# EAGLE design AlarmClock (EAGLE 9.6.2)
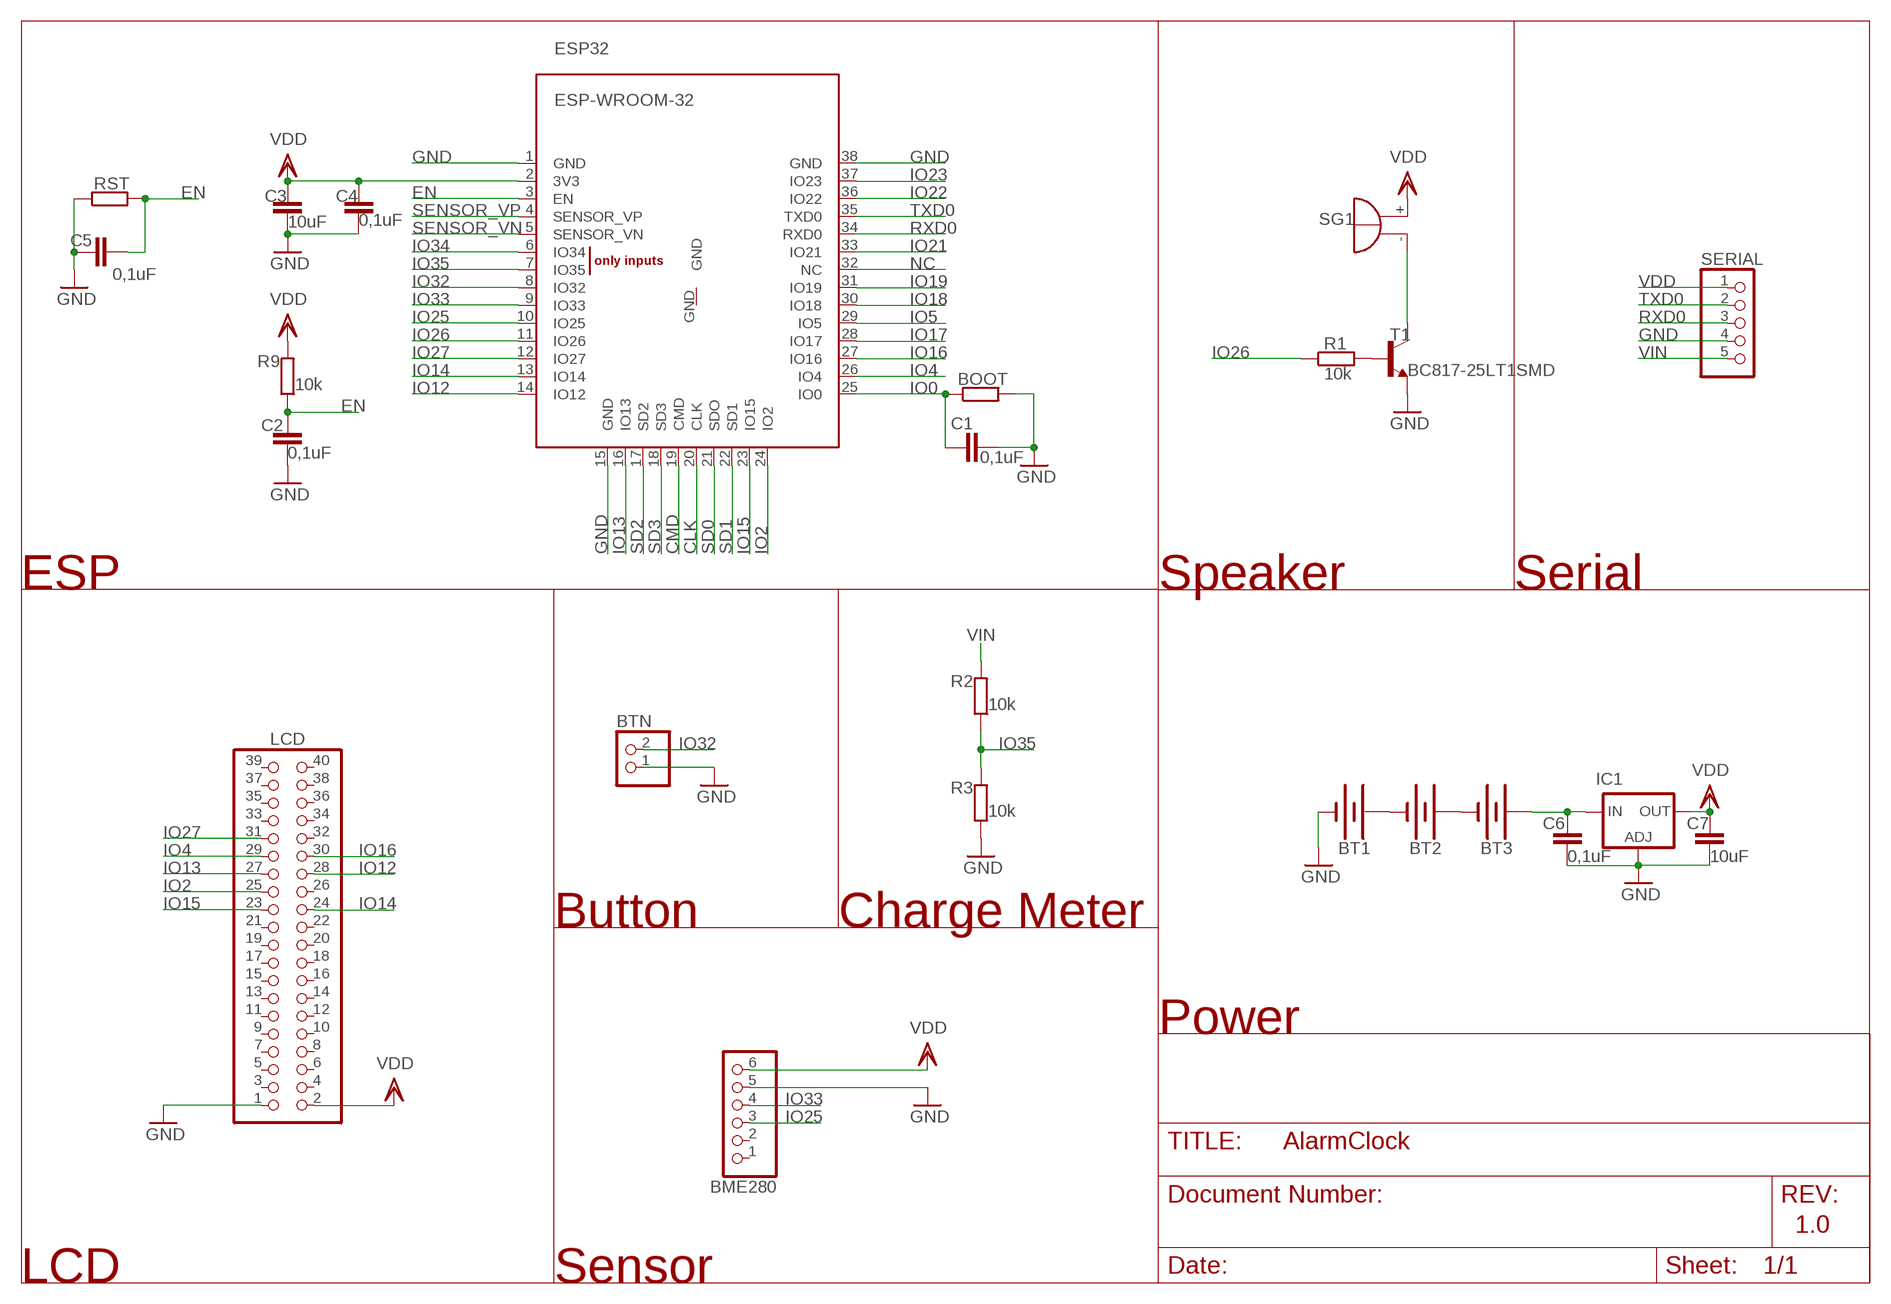
[diagram p0: schematic, sheet 1]

## Parts
BME280  PINHD-1X6  [1X06]
BOOT  R-EU_R1206  [R1206]
BT1  HALTER1XUM4-LF  [HALTER1XUM4-LF]
BT2  HALTER1XUM4-LF  [HALTER1XUM4-LF]
BT3  HALTER1XUM4-LF  [HALTER1XUM4-LF]
BTN  PINHD-1X2_2.54  [1X02]
C1  0,1uF  C-EUC1206  [C1206]
C2  0,1uF  C-EUC1206  [C1206]
C3  10uF  C-EUC1206  [C1206]
C4  0,1uF  C-EUC1206  [C1206]
C5  0,1uF  C-EUC1206  [C1206]
C6  0,1uF  C-EUC1206  [C1206]
C7  10uF  C-EUC1206  [C1206]
ESP32  ESP-WROOM-32  [ESP-WROOM-32]
IC1  LD1117AS33TR  LD117AS33TR  [SOT223]
LCD  PINHD-2X20  [2X20]
R1  10k  R-EU_R1206  [R1206]
R2  10k  R-EU_R1206  [R1206]
R3  10k  R-EU_R1206  [R1206]
R9  10k  R-EU_R1206  [R1206]
RST  R-EU_R1206  [R1206]
SERIAL  PINHD-1X5_2.54-SMD-90°  [1X05SMD/90]
SG1  F/QMB  [F/QMB]
T1  BC817-25LT1SMD  [SOT23-BEC]

## Nets
CLK: ESP32.20(CLK)
CMD: ESP32.19(CMD)
EN: C2.2 C5.2 ESP32.3(EN) R9.1 RST.2
GND: BME280.5 BOOT.2 BT1.P$2(-) BTN.1 C1.1 C2.1 C3.1 C4.1 C5.1 C6.1 C7.1 ESP32.1(GND) ESP32.15(GND) ESP32.38(GND) IC1.1(ADJ) LCD.1 R3.1 RST.1 SERIAL.4 T1.E
IO0: BOOT.1 C1.2 ESP32.25(IO0)
IO2: ESP32.24(IO2) LCD.25
IO4: ESP32.26(IO4) LCD.29
IO5: ESP32.29(IO5)
IO12: ESP32.14(IO12) LCD.28
IO13: ESP32.16(IO13) LCD.27
IO14: ESP32.13(IO14) LCD.24
IO15: ESP32.23(IO15) LCD.23
IO16: ESP32.27(IO16) LCD.30
IO17: ESP32.28(IO17)
IO18: ESP32.30(IO18)
IO19: ESP32.31(IO19)
IO21: ESP32.33(IO21)
IO22: ESP32.36(IO22)
IO23: ESP32.37(IO23)
IO25: BME280.3 ESP32.10(IO25)
IO26: ESP32.11(IO26) R1.1
IO27: ESP32.12(IO27) LCD.31
IO32: BTN.2 ESP32.8(IO32)
IO33: BME280.4 ESP32.9(IO33)
IO34: ESP32.6(IO34)
IO35: ESP32.7(IO35) R2.1 R3.2
N$1: SG1.-(+) T1.C
N$5: BT1.P$1(+) BT2.P$2(-)
N$6: BT2.P$1(+) BT3.P$2(-)
N$7: R1.2 T1.B
NC: ESP32.32(NC)
RXD0: ESP32.34(RXD0) SERIAL.3
SD0: ESP32.21(SDO)
SD1: ESP32.22(SD1)
SD2: ESP32.17(SD2)
SD3: ESP32.18(SD3)
SENSOR_VN: ESP32.5(SENSOR_VN)
SENSOR_VP: ESP32.4(SENSOR_VP)
TXD0: ESP32.35(TXD0) SERIAL.2
VDD: BME280.6 C3.2 C4.2 C7.2 ESP32.2(3V3) IC1.4(OUT) LCD.2 R9.2 SERIAL.1 SG1.+(-)
VIN: BT3.P$1(+) C6.2 IC1.3(IN) R2.2 SERIAL.5
Unconnected: BME280.1 BME280.2 ESP32.GND LCD.3 LCD.4 LCD.5 LCD.6 LCD.7 LCD.8 LCD.9 LCD.10 LCD.11 LCD.12 LCD.13 LCD.14 LCD.15 LCD.16 LCD.17 LCD.18 LCD.19 LCD.20 LCD.21 LCD.22 LCD.26 LCD.32 LCD.33 LCD.34 LCD.35 LCD.36 LCD.37 LCD.38 LCD.39 LCD.40

## Notes on the sheet
- ESP | Speaker | Serial
- Button | Charge Meter
- Power
- 1.0
- LCD | Sensor

## Library data of the parts
BME280 = pinhead:PINHD-1X6: PIN HEADER
BOOT R1-R3 R9 RST = rcl:R-EU_: RESISTOR, European symbol; SPICEPREFIX: R
BT1-BT3 = TheLibrary:HALTER1XUM4-LF
BTN = pinhead-ext:PINHD-1X2: PIN HEADER
C1-C7 = rcl:C-EU: CAPACITOR, European symbol; SPICEPREFIX: C
ESP32 = esp32:ESP-WROOM-32
IC1 = v-reg:LD117A?*: Low drop fixed and adjustable positive voltage regulators 1 A Source: http://www.st.com/stonline/products/literature/ds/7194/ld1117axx.pdf
LCD = pinhead:PINHD-2X20: PIN HEADER
SERIAL = pinhead-ext:PINHD-1X5: PIN HEADER
SG1 = buzzer:F/QMB: BUZZER Source: Buerklin; OC_FARNELL: unknown; OC_NEWARK: unknown
T1 = transistor-npn:BC817*: NPN Transistor

## Net classes
1 power: width 0.178 mm

## Board
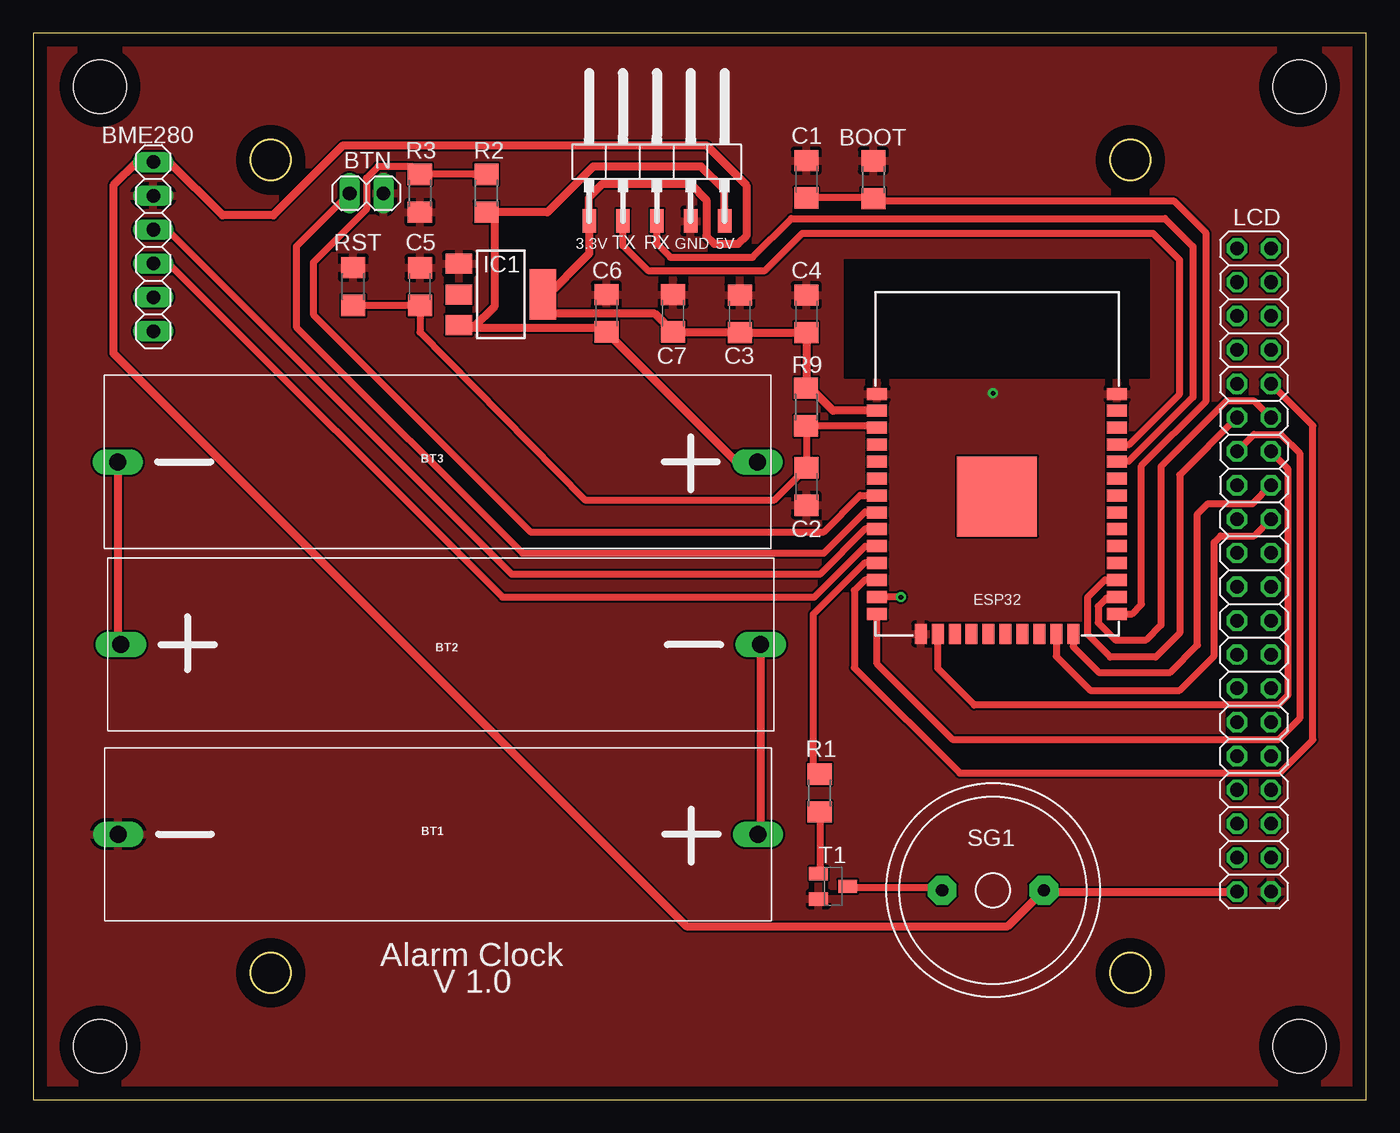
[diagram p1: board, top side]
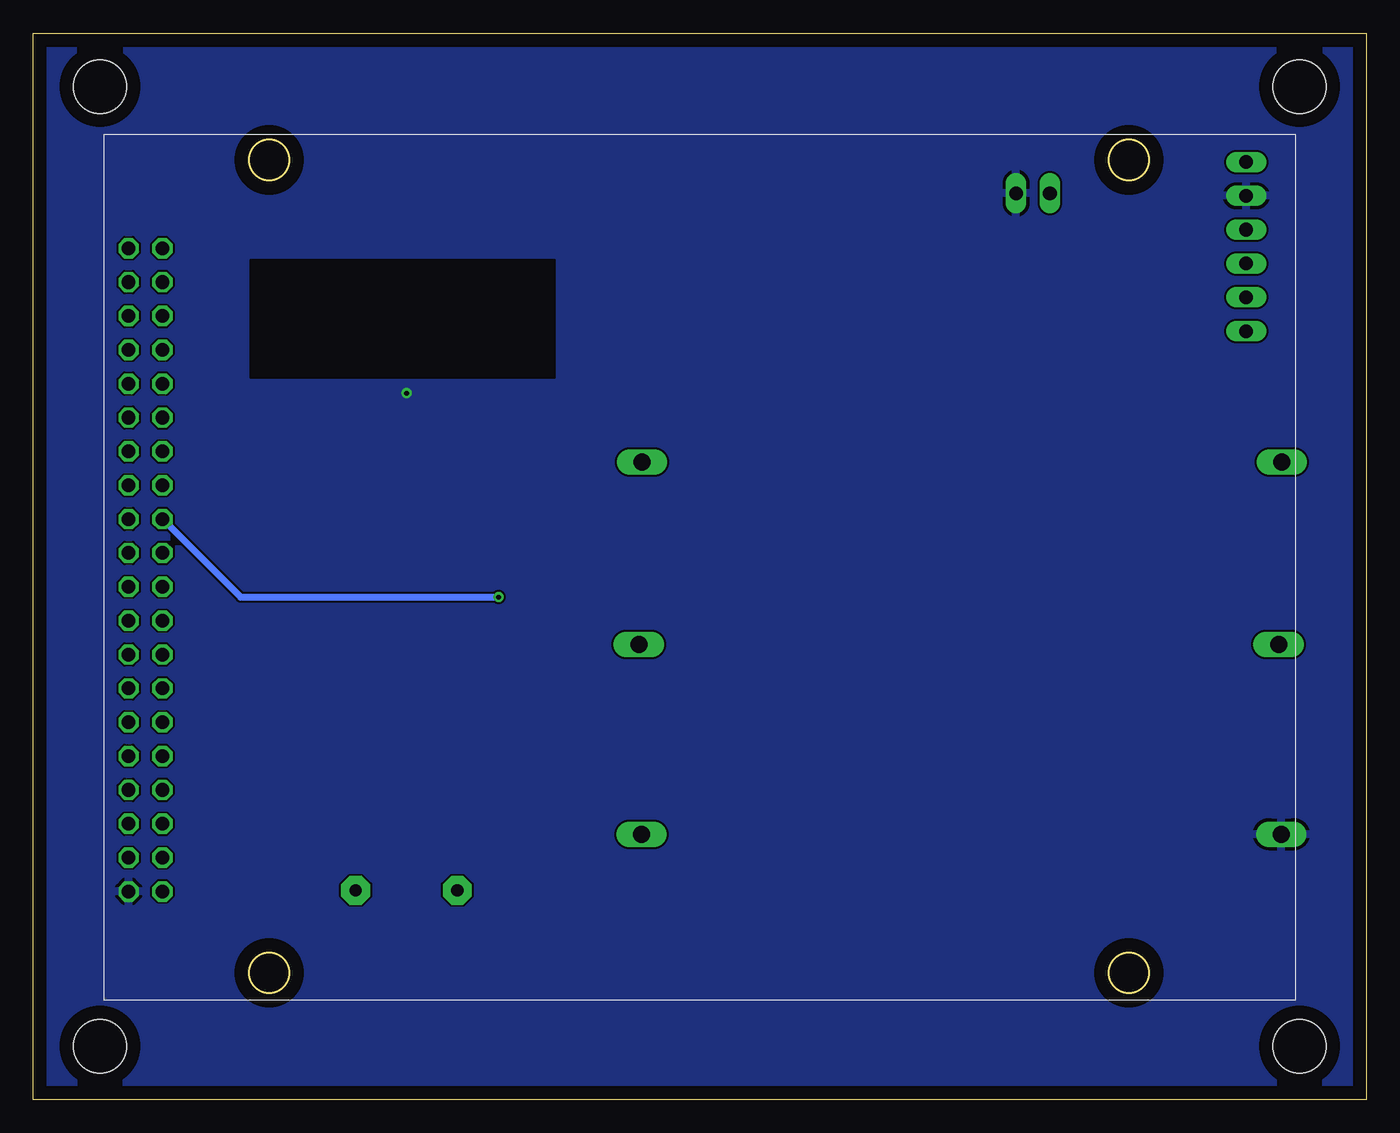
[diagram p2: board, bottom side, seen from below]

Size 100 x 80 mm. Coordinates in mm from the lower left corner, seen from the top.
Outline: 0,0 100,0 100,80 0,80 0,0
Outline: circle at 17.8,9.5 radius 1.5
Outline: circle at 82.3,9.5 radius 1.5
Outline: circle at 82.3,70.5 radius 1.5
Outline: circle at 17.8,70.5 radius 1.5
Copper layers (1*16): Top 0.035mm / dielectric 1.5mm / Bottom 0.035mm
Design rules "default": minimum track width 6mil, minimum drill 0.35mm, track to track 6mil, track to pad 6mil, pad to pad 6mil, via to via 6mil, smd to smd 6mil, copper to edge 40mil, drill to drill 6mil, minimum pad ring 10mil, minimum via ring 8mil, stop-mask expansion 4mil, vias tented up to drill 0mil, thermal gap 10mil
Holes 4 mm at 5,76 5,4 95,4 95,76

### Footprints (pad centres in the part's own frame; a part is rotated, then mirrored left to right if it is on the bottom)
1X06 = drill 1.016 long: 1 -6.35,0; 2 -3.81,0; 3 -1.27,0; 4 1.27,0; 5 3.81,0; 6 6.35,0
R1206 = smd 1.6 x 1.803: 1 -1.422,0; 2 1.422,0
HALTER1XUM4-LF = drill 1.27 long: P$1 -24.4,0.15; P$2 23.6,0.15
1X02 = drill 1.016 long: 1 -1.27,0; 2 1.27,0
C1206 = smd 1.6 x 1.8: 1 -1.4,0; 2 1.4,0
ESP-WROOM-32 = smd 0.9 x 1.5: 1 7.7,9; 2 6.43,9; 3 5.16,9; 4 3.89,9; 5 2.62,9; 6 1.35,9; 7 0.08,9; 8 -1.19,9; 9 -2.46,9; 10 -3.73,9; 11 -5,9; 12 -6.27,9; 13 -7.54,9; 14 -8.81,9; 25 -8.81,-9; 26 -7.54,-9; 27 -6.27,-9; 28 -5,-9; 29 -3.73,-9; 30 -2.46,-9; 31 -1.19,-9; 32 0.08,-9; 33 1.35,-9; 34 2.62,-9; 35 3.89,-9; 36 5.16,-9; 37 6.43,-9; 38 7.7,-9 | smd 1.5 x 0.9: 15 -10.3,5.715; 16 -10.3,4.445; 17 -10.3,3.175; 18 -10.3,1.905; 19 -10.3,0.635; 20 -10.3,-0.635; 21 -10.3,-1.905; 22 -10.3,-3.175; 23 -10.3,-4.445; 24 -10.3,-5.715 | smd 6 x 6: GND 0,0
SOT223 = smd 1.5 x 2: 1 -2.3,-3.15; 2 0,-3.15; 3 2.3,-3.15 | smd 3.8 x 2: 4 0,3.15
2X20 = drill 1.016 octagon: 1 -24.13,-1.27; 2 -24.13,1.27; 3 -21.59,-1.27; 4 -21.59,1.27; 5 -19.05,-1.27; 6 -19.05,1.27; 7 -16.51,-1.27; 8 -16.51,1.27; 9 -13.97,-1.27; 10 -13.97,1.27; 11 -11.43,-1.27; 12 -11.43,1.27; 13 -8.89,-1.27; 14 -8.89,1.27; 15 -6.35,-1.27; 16 -6.35,1.27; 17 -3.81,-1.27; 18 -3.81,1.27; 19 -1.27,-1.27; 20 -1.27,1.27; 21 1.27,-1.27; 22 1.27,1.27; 23 3.81,-1.27; 24 3.81,1.27; 25 6.35,-1.27; 26 6.35,1.27; 27 8.89,-1.27; 28 8.89,1.27; 29 11.43,-1.27; 30 11.43,1.27; 31 13.97,-1.27; 32 13.97,1.27; 33 16.51,-1.27; 34 16.51,1.27; 35 19.05,-1.27; 36 19.05,1.27; 37 21.59,-1.27; 38 21.59,1.27; 39 24.13,-1.27; 40 24.13,1.27
1X05SMD/90 = smd 1.016 x 1.778: 1 -1.27,-5.08; 2 1.27,-5.08; 3 3.81,-5.08; 4 6.35,-5.08; 5 8.89,-5.08
F/QMB = drill 0.914 pad 2.159 octagon: + 3.81,0; - -3.81,0
SOT23-BEC = smd 1 x 1.4: B -0.95,-1.1; C 0,1.1; E 0.95,-1.1

### Placement (x,y rotation side)
BME280  9,64 90 top
BOOT  63.02,69.01 90 top
BT1  29.97,20.05 180 top
BT2  30.97,33.99 0 top
BT3  29.93,47.99 180 top
BTN  25,68 180 top
C1  58,69.05 270 top
C2  58,46 90 top
C3  53,58.95 270 top
C4  58,58.95 270 top
C5  29,61 270 top
C6  43,59 270 top
C7  48,59 270 top
ESP32  72.3,45.25 90 top
IC1  35.08,60.41 270 top
LCD  91.58,39.74 90 top
R1  59,23 270 top
R2  34,68 270 top
R3  29,68 90 top
R9  57.98,51.96 90 top
RST  24,61 270 top
SERIAL  42.97,71 0 top
SG1  72,15.7 0 top
T1  60,16 270 top

### Tracks (layer width: path | path; a pad name or v marks a point on that pad's centre or on a via)
EN
  Top 0.508: ESP32.3 63.17,50.54 R9.1 58,50.52 C2.2 55.6,45 41.38,45 29,57.57 C5.2 | 29.42,59.02 C5.2 | C5.2 28.98,59.58 RST.2
GND  (via drill 0.35)
  other vias: 72,53
  pour Top: 0,80 100,80 100,0 0,0
  pour Bottom: 0,80 100,80 100,0 0,0
IO0
  Top 0.508: ESP32.25 82.44,36.44 83.15,37.15 83.15,47.55 88,52.41 88,65 85.61,67.39 63.22,67.39 BOOT.1 62.96,67.65 C1.2
IO2
  Top 0.508: ESP32.24 78.02,34.02 78,34 79.94,32.06 85.29,32.06 87.34,34.11 87.34,43.93 88.13,44.72 91.48,44.72 LCD.25
IO4
  Top 0.508: LCD.29 91.62,52.4 89.5,52.4 84.6,47.5 84.6,35.6 83.5,34.5 81.17,34.5 79.9,35.77 79.9,37.01 80.5,37.61 81.2,37.61 ESP32.26
IO12
  Top 0.508: LCD.28 91.58,49.9 93.6,49.9 95,48.5 95,28.6 93.4,27 69,27 63.3,32.7 ESP32.14
IO13
  Top 0.508: LCD.27 94.12,47.36 94.12,30.31 93.41,29.6 70.6,29.6 67.86,32.34 ESP32.16
IO14  (via drill 0.35)
  Top 0.508: v65.1,37.7 v65.09,37.71 ESP32.13
  Bottom 0.508: LCD.24 84.46,37.7 v65.1,37.7
IO15
  Top 0.508: ESP32.23 76.75,33.26 79.3,30.7 86,30.7 88.6,33.3 88.6,41.8 89.08,42.28 91.59,42.28 92.85,43.54 LCD.23
IO16
  Top 0.508: ESP32.27 81.28,39 80.4,39 79.1,37.7 79.1,34.9 80.8,33.2 84.2,33.2 86,35 86,46.86 LCD.30
  Bottom 0.508: LCD.30 90.17,51.17
IO25
  Top 0.508: BME280.3 10.17,62.73 35.2,37.7 58.6,37.7 62.42,41.52 ESP32.10
IO26
  Top 0.508: ESP32.11 62.35,40.25 58.5,36.4 58.5,24.92 R1.1
IO27
  Top 0.508: ESP32.12 62.38,38.98 61.6,38.2 61.6,32.4 69.5,24.5 93.5,24.5 96,27 96,50.56 LCD.31
IO32
  Top 0.508: ESP32.8 63.29,44.05 63.23,44.1 62.4,44.1 59.3,41 36.7,41 19.73,57.97 19.73,64 BTN.2
IO33
  Top 0.508: ESP32.9 62.39,42.79 59,39.4 35.9,39.4 10.03,65.27 BME280.4
IO35
  Top 0.508: ESP32.7 62.03,45.33 59.3,42.6 37.3,42.6 21,58.9 21,62.8 25,66.8 25,69.14 25.86,70 28.42,70 R3.2 R2.1 33,69.42
N$1
  Top 0.508: T1.C 61.2,15.9 67.99,15.9 SG1.-
N$5
  Top 0.61: BT2.P$2 54.57,20.1 BT1.P$1
N$6
  Top 0.61: BT3.P$2 6.33,34.38 BT2.P$1
N$7
  Top 0.508: R1.2 59,17.05 T1.B
RXD0
  Top 0.508: ESP32.34 82.17,47.87 87,52.7 87,64 84.9,66.1 56.87,66.1 53.97,63.2 47.8,63.2 46.78,64.22 SERIAL.3
TXD0
  Top 0.508: ESP32.35 81.31,49.15 82.22,49.15 86,52.94 86,63 84,65 57.7,65 54.9,62.2 46.1,62.2 44.24,64.06 SERIAL.2
VDD
  Top 0.508: LCD.2
  Top 0.61: ESP32.2 60,51.68 58.3,53.38 R9.2 58,53.4 C4.2 C3.2 52.95,57.6 C7.2 46.64,58.96 38.88,58.96 38.23,59.61 38.23,60 | SERIAL.1 41.7,67.7 42.7,68.7 49.3,68.7 50.5,67.5 50.5,64.8 51.1,64.2 52.9,64.2 53.5,64.8 53.5,68.6 50.5,71.6 23.25,71.6 18,66.35 14.2,66.35 10.2,70.35 BME280.6 7.75,70.35 6,68.6 6,56 49,13 73.11,13 SG1.+ 75.91,15.6 LCD.2 | 38.8,60.41 IC1.4 38.23,60 | 41.62,66 SERIAL.1 | SERIAL.1 41.7,63.47 38.23,60
VIN
  Top 0.61: SERIAL.5 51.8,65.98 51.8,68.3 50.1,70 42,70 38.58,66.58 R2.2 34.6,65.98 34.6,59.5 33.01,57.91 32.13,57.91 IC1.3 32.14,57.9 42.7,57.9 C6.2 52.76,47.84 BT3.P$1

### Text on the board
tNames: 3.3V | TX | RX | GND | 5V | Alarm Clock | V 1.0